# EAGLE schematic ground_logic_thing_v1 (EAGLE 9.7.0)
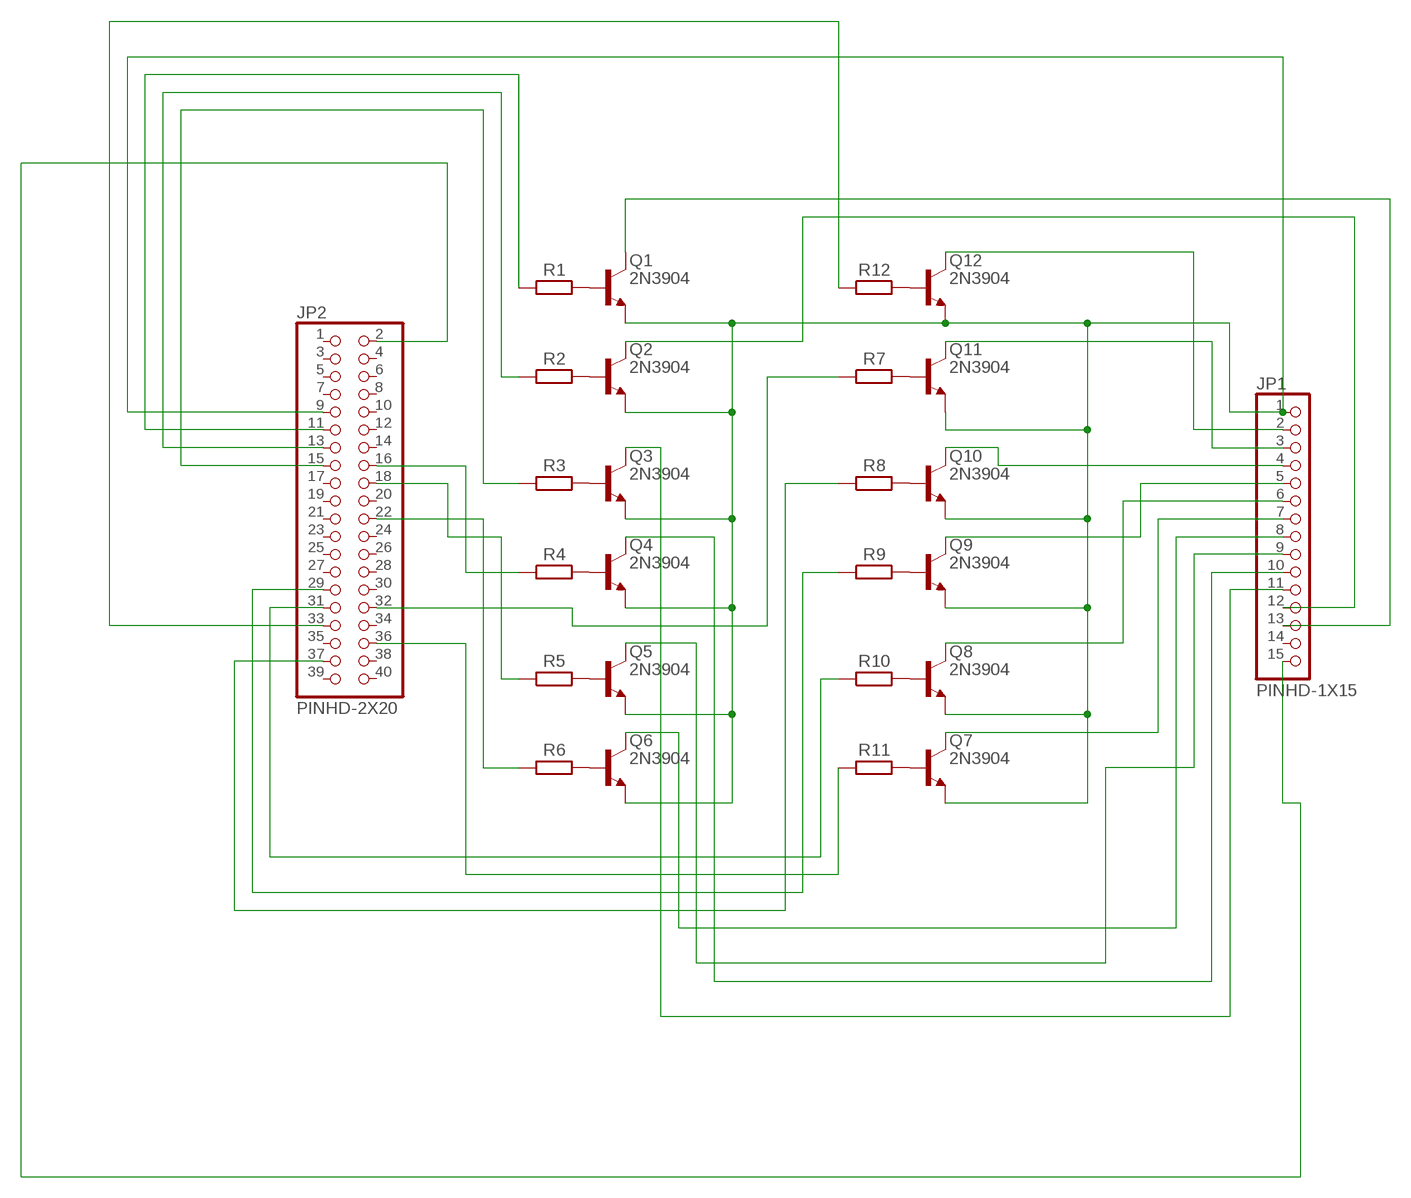
[diagram p0: schematic, sheet 1]

## Parts
JP1  PINHD-1X15  [1X15]
JP2  PINHD-2X20  [2X20]
Q1  2N3904  NPN_2N3904_TO92  [TO92]
Q2  2N3904  NPN_2N3904_TO92  [TO92]
Q3  2N3904  NPN_2N3904_TO92  [TO92]
Q4  2N3904  NPN_2N3904_TO92  [TO92]
Q5  2N3904  NPN_2N3904_TO92  [TO92]
Q6  2N3904  NPN_2N3904_TO92  [TO92]
Q7  2N3904  NPN_2N3904_TO92  [TO92]
Q8  2N3904  NPN_2N3904_TO92  [TO92]
Q9  2N3904  NPN_2N3904_TO92  [TO92]
Q10  2N3904  NPN_2N3904_TO92  [TO92]
Q11  2N3904  NPN_2N3904_TO92  [TO92]
Q12  2N3904  NPN_2N3904_TO92  [TO92]
R1  R_AXIAL-7.2MM-PITCH  [RESAD724W46L381D178B]
R2  R_AXIAL-7.2MM-PITCH  [RESAD724W46L381D178B]
R3  R_AXIAL-7.2MM-PITCH  [RESAD724W46L381D178B]
R4  R_AXIAL-7.2MM-PITCH  [RESAD724W46L381D178B]
R5  R_AXIAL-7.2MM-PITCH  [RESAD724W46L381D178B]
R6  R_AXIAL-7.2MM-PITCH  [RESAD724W46L381D178B]
R7  R_AXIAL-7.2MM-PITCH  [RESAD724W46L381D178B]
R8  R_AXIAL-7.2MM-PITCH  [RESAD724W46L381D178B]
R9  R_AXIAL-7.2MM-PITCH  [RESAD724W46L381D178B]
R10  R_AXIAL-7.2MM-PITCH  [RESAD724W46L381D178B]
R11  R_AXIAL-7.2MM-PITCH  [RESAD724W46L381D178B]
R12  R_AXIAL-7.2MM-PITCH  [RESAD724W46L381D178B]

## Nets
N$1: Q1.2(B) R1.2
N$2: Q2.2(B) R2.2
N$3: Q3.2(B) R3.2
N$4: Q4.2(B) R4.2
N$5: Q5.2(B) R5.2
N$6: Q6.2(B) R6.2
N$7: Q11.2(B) R7.2
N$8: Q10.2(B) R8.2
N$9: Q9.2(B) R9.2
N$10: Q8.2(B) R10.2
N$11: Q7.2(B) R11.2
N$12: Q12.2(B) R12.2
N$13: JP1.1 JP2.9 Q1.1(E) Q2.1(E) Q3.1(E) Q4.1(E) Q5.1(E) Q6.1(E) Q7.1(E) Q8.1(E) Q9.1(E) Q10.1(E) Q11.1(E) Q12.1(E)
N$14: JP2.11 R1.1
N$15: JP2.13 R2.1
N$16: JP2.15 R3.1
N$17: JP2.16 R4.1
N$18: JP2.18 R5.1
N$19: JP2.22 R6.1
N$20: JP2.36 R11.1
N$21: JP2.31 R10.1
N$22: JP2.29 R9.1
N$23: JP2.37 R8.1
N$24: JP2.32 R7.1
N$25: JP2.33 R12.1
N$26: JP1.15 JP2.2
N$27: JP1.2 Q12.3(C)
N$28: JP1.3 Q11.3(C)
N$29: JP1.4 Q10.3(C)
N$30: JP1.5 Q9.3(C)
N$31: JP1.6 Q8.3(C)
N$32: JP1.7 Q7.3(C)
N$33: JP1.8 Q6.3(C)
N$34: JP1.9 Q5.3(C)
N$35: JP1.10 Q4.3(C)
N$36: JP1.11 Q3.3(C)
N$37: JP1.12 Q2.3(C)
N$38: JP1.13 Q1.3(C)
Unconnected: JP1.14 JP2.1 JP2.3 JP2.4 JP2.5 JP2.6 JP2.7 JP2.8 JP2.10 JP2.12 JP2.14 JP2.17 JP2.19 JP2.20 JP2.21 JP2.23 JP2.24 JP2.25 JP2.26 JP2.27 JP2.28 JP2.30 JP2.34 JP2.35 JP2.38 JP2.39 JP2.40

## Library data of the parts
JP1 = Connector:PINHD-1X15: PIN HEADER; CATEGORY: CONNECTOR; SUB-CATEGORY: PIN-HEADER
JP2 = Connector:PINHD-2X20: PIN HEADER; CATEGORY: CONNECTOR; SUB-CATEGORY: PIN-HEADER
Q1-Q12 = Transistor:NPN_: NPN - Popular parts; CATEGORY: Transistor; SUB-CATEGORY: BJT; TYPE: NPN
R1-R12 = Resistor:R: Resistor Fixed - Generic; CATEGORY: Resistor; SUB-CATEGORY: Fixed